# Altium project meter.PrjPCB
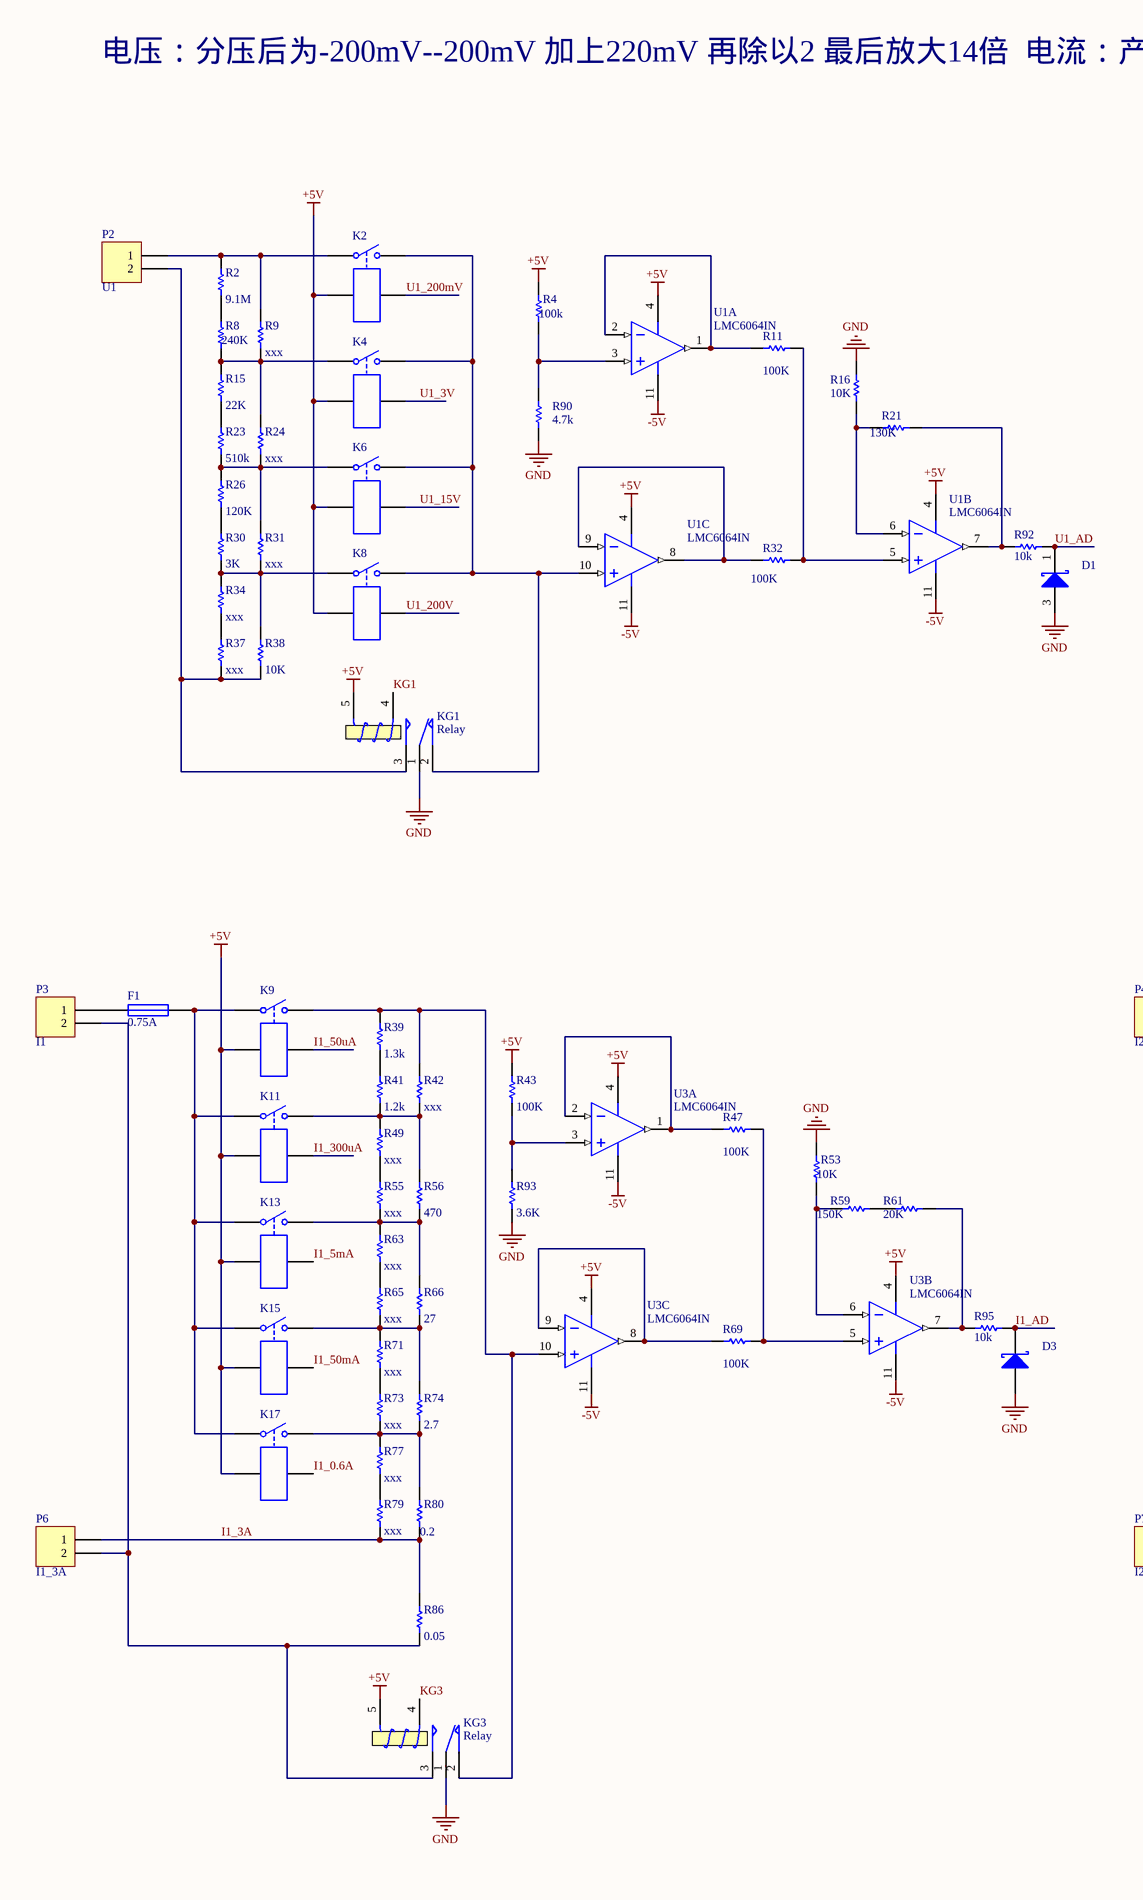
[diagram p0: Sheet.SchDoc, left]
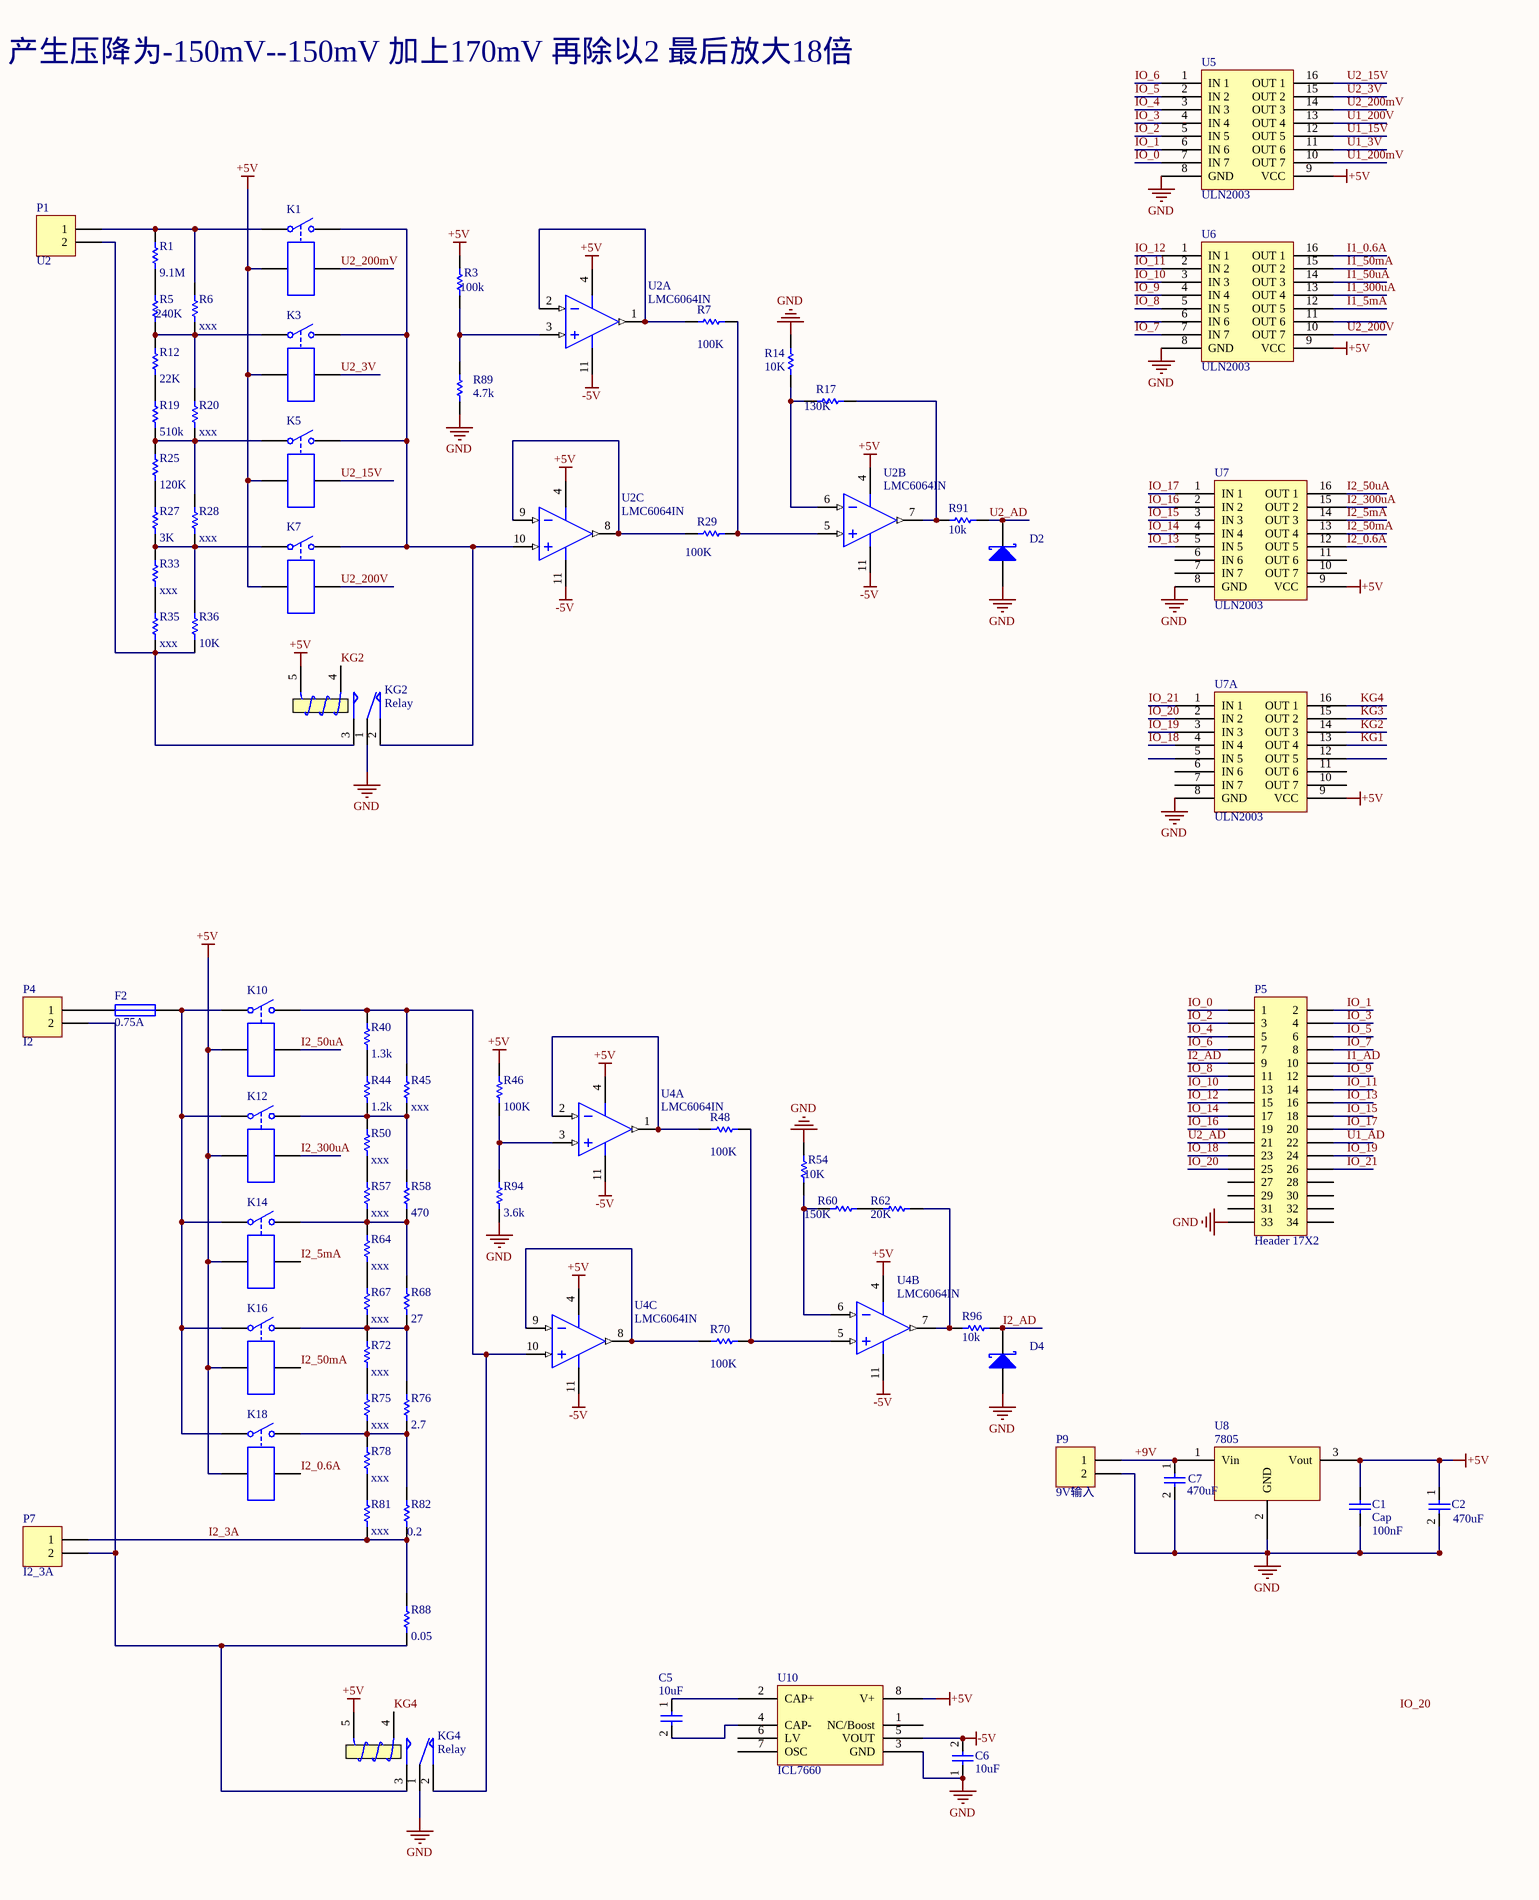
[diagram p1: Sheet.SchDoc, right]
1 sheet, 137 parts. Net scope: global (net labels, ports and power ports of the same name join across sheets).
Board file: PCB.PcbDoc

## Sheet Sheet.SchDoc
size A2

### Parts
C1  Cap  value 100nF  [0805]
C2  value 470uF  [RB8mm_3.5mm]  (hidden comment: Cap)
C5  value 10uF  [RB4.5mm_1.5mm]  (hidden comment: Cap)
C6  value 10uF  [RB4.5mm_1.5mm]  (hidden comment: Cap)
C7  value 470uF  [RB8mm_3.5mm]  (hidden comment: Cap)
D1  (no value)  [D1206]
D2  (no value)  [D1206]
D3  (no value)  [D1206]
D4  (no value)  [D1206]
F1  0.75A  [1812]
F2  0.75A  [1812]
K1  Relay-SPST  [MyRelay]  (value not drawn)
K2  Relay-SPST  [MyRelay]  (value not drawn)
K3  Relay-SPST  [MyRelay]  (value not drawn)
K4  Relay-SPST  [MyRelay]  (value not drawn)
K5  Relay-SPST  [MyRelay]  (value not drawn)
K6  Relay-SPST  [MyRelay]  (value not drawn)
K7  Relay-SPST  [MyRelay]  (value not drawn)
K8  Relay-SPST  [MyRelay]  (value not drawn)
K9  Relay-SPST  [MyRelay]  (value not drawn)
K10  Relay-SPST  [MyRelay]  (value not drawn)
K11  Relay-SPST  [MyRelay]  (value not drawn)
K12  Relay-SPST  [MyRelay]  (value not drawn)
K13  Relay-SPST  [MyRelay]  (value not drawn)
K14  Relay-SPST  [MyRelay]  (value not drawn)
K15  Relay-SPST  [MyRelay]  (value not drawn)
K16  Relay-SPST  [MyRelay]  (value not drawn)
K17  Relay-SPST  [MyRelay]  (value not drawn)
K18  Relay-SPST  [MyRelay]  (value not drawn)
KG1  Relay  [RELAY_HK4101F]
KG2  Relay  [RELAY_HK4101F]
KG3  Relay  [RELAY_HK4101F]
KG4  Relay  [RELAY_HK4101F]
P1  U2  [MyCon2]
P2  U1  [MyCon2]
P3  I1  [MyCon2]
P4  I2  [MyCon2]
P5  Header 17X2  [IDC34S]
P6  I1_3A  [MyCon2]
P7  I2_3A  [MyCon2]
P9  9V输入  [XH2.0-2p]
R1  value 9.1M  [0603R]  (hidden comment: Res1)
R2  value 9.1M  [0603R]  (hidden comment: Res1)
R3  value 100k  [0603R]  (hidden comment: Res1)
R4  value 100k  [0603R]  (hidden comment: Res1)
R5  value 240K  [0603R]  (hidden comment: Res1)
R6  value xxx  [0603R]  (hidden comment: Res1)
R7  value 100K  [0603R]  (hidden comment: Res1)
R8  value 240K  [0603R]  (hidden comment: Res1)
R9  value xxx  [0603R]  (hidden comment: Res1)
R11  value 100K  [0603R]  (hidden comment: Res1)
R12  value 22K  [0603R]  (hidden comment: Res1)
R14  value 10K  [0603R]  (hidden comment: Res1)
R15  value 22K  [0603R]  (hidden comment: Res1)
R16  value 10K  [0603R]  (hidden comment: Res1)
R17  value 130K  [0603R]  (hidden comment: Res1)
R19  value 510k  [0603R]  (hidden comment: Res1)
R20  value xxx  [0603R]  (hidden comment: Res1)
R21  value 130K  [0603R]  (hidden comment: Res1)
R23  value 510k  [0603R]  (hidden comment: Res1)
R24  value xxx  [0603R]  (hidden comment: Res1)
R25  value 120K  [0603R]  (hidden comment: Res1)
R26  value 120K  [0603R]  (hidden comment: Res1)
R27  value 3K  [0603R]  (hidden comment: Res1)
R28  value xxx  [0603R]  (hidden comment: Res1)
R29  value 100K  [0603R]  (hidden comment: Res1)
R30  value 3K  [0603R]  (hidden comment: Res1)
R31  value xxx  [0603R]  (hidden comment: Res1)
R32  value 100K  [0603R]  (hidden comment: Res1)
R33  value xxx  [0603R]  (hidden comment: Res1)
R34  value xxx  [0603R]  (hidden comment: Res1)
R35  value xxx  [0603R]  (hidden comment: Res1)
R36  value 10K  [0603R]  (hidden comment: Res1)
R37  value xxx  [0603R]  (hidden comment: Res1)
R38  value 10K  [0603R]  (hidden comment: Res1)
R39  value 1.3k  [1206]  (hidden comment: Res1)
R40  value 1.3k  [1206]  (hidden comment: Res1)
R41  value 1.2k  [1206]  (hidden comment: Res1)
R42  value xxx  [1206]  (hidden comment: Res1)
R43  value 100K  [0603R]  (hidden comment: Res1)
R44  value 1.2k  [1206]  (hidden comment: Res1)
R45  value xxx  [1206]  (hidden comment: Res1)
R46  value 100K  [0603R]  (hidden comment: Res1)
R47  value 100K  [0603R]  (hidden comment: Res1)
R48  value 100K  [0603R]  (hidden comment: Res1)
R49  value xxx  [1206]  (hidden comment: Res1)
R50  value xxx  [1206]  (hidden comment: Res1)
R53  value 10K  [0603R]  (hidden comment: Res1)
R54  value 10K  [0603R]  (hidden comment: Res1)
R55  value xxx  [1206]  (hidden comment: Res1)
R56  value 470  [1206]  (hidden comment: Res1)
R57  value xxx  [1206]  (hidden comment: Res1)
R58  value 470  [1206]  (hidden comment: Res1)
R59  value 150K  [0603R]  (hidden comment: Res1)
R60  value 150K  [0603R]  (hidden comment: Res1)
R61  value 20K  [0603R]  (hidden comment: Res1)
R62  value 20K  [0603R]  (hidden comment: Res1)
R63  value xxx  [1206]  (hidden comment: Res1)
R64  value xxx  [1206]  (hidden comment: Res1)
R65  value xxx  [1206]  (hidden comment: Res1)
R66  value 27  [1206]  (hidden comment: Res1)
R67  value xxx  [1206]  (hidden comment: Res1)
R68  value 27  [1206]  (hidden comment: Res1)
R69  value 100K  [0603R]  (hidden comment: Res1)
R70  value 100K  [0603R]  (hidden comment: Res1)
R71  value xxx  [1206]  (hidden comment: Res1)
R72  value xxx  [1206]  (hidden comment: Res1)
R73  value xxx  [1206]  (hidden comment: Res1)
R74  value 2.7  [1206]  (hidden comment: Res1)
R75  value xxx  [1206]  (hidden comment: Res1)
R76  value 2.7  [1206]  (hidden comment: Res1)
R77  value xxx  [1206]  (hidden comment: Res1)
R78  value xxx  [1206]  (hidden comment: Res1)
R79  value xxx  [1206]  (hidden comment: Res1)
R80  value 0.2  [1206]  (hidden comment: Res1)
R81  value xxx  [1206]  (hidden comment: Res1)
R82  value 0.2  [1206]  (hidden comment: Res1)
R86  value 0.05  [MY2512]  (hidden comment: Res1)
R88  value 0.05  [MY2512]  (hidden comment: Res1)
R89  value 4.7k  [0603R]  (hidden comment: Res1)
R90  value 4.7k  [0603R]  (hidden comment: Res1)
R91  value 10k  [0603R]  (hidden comment: Res1)
R92  value 10k  [0603R]  (hidden comment: Res1)
R93  value 3.6K  [0603R]  (hidden comment: Res1)
R94  value 3.6k  [0603R]  (hidden comment: Res1)
R95  value 10k  [0603R]  (hidden comment: Res1)
R96  value 10k  [0603R]  (hidden comment: Res1)
U1  LMC6064IN  [N14A]  (parts A,B,C of 4)
U2  LMC6064IN  [N14A]  (parts A,B,C of 4)
U3  LMC6064IN  [N14A]  (parts A,B,C of 4)
U4  LMC6064IN  [N14A]  (parts A,B,C of 4)
U5  ULN2003  [DIP16]
U6  ULN2003  [DIP16]
U7  ULN2003  [DIP16]
U7A  ULN2003  [DIP16]
U8  7805  [78xx]
U10  ICL7660  [DIP8]

### Nets
+5V: C1.2 C2.1 K1.3 K2.3 K3.3 K4.3 K5.3 K6.3 K7.3 K8.3 K9.3 K10.3 K11.3 K12.3 K13.3 K14.3 K15.3 K16.3 K17.3 K18.3 KG1.5(T2) KG2.5(T2) KG3.5(T2) KG4.5(T2) R3.2 R4.2 R43.2 R46.2 U1.4(V+) U2.4(V+) U3.4(V+) U4.4(V+) U5.9(VCC) U6.9(VCC) U7.9(VCC) U7A.9(VCC) U8.3(Vout) U10.8(V+)
-5V: C6.2 U1.11(V-) U2.11(V-) U3.11(V-) U4.11(V-) U10.5(VOUT)
GND: C1.1 C2.2 C6.1 C7.2 D1.3(A) D2.3(A) D3.3(A) D4.3(A) KG1.1(COM) KG2.1(COM) KG3.1(COM) KG4.1(COM) P5.33 P9.2 R14.1 R16.1 R53.1 R54.1 R89.1 R90.1 R93.1 R94.1 U5.8(GND) U6.8(GND) U7.8(GND) U7A.8(GND) U8.2(GND) U10.3(GND)
+9V: C7.1 P9.1 U8.1(Vin)
I1_0.6A: K17.4 U6.16(OUT_1)
I1_3A: P6.1 R79.1 R80.1 R86.2
I1_5mA: K13.4 U6.12(OUT_5)
I1_50mA: K15.4 U6.15(OUT_2)
I1_50uA: K9.4 U6.14(OUT_3)
I1_300uA: K11.4 U6.13(OUT_4)
I1_AD: D3.1(K) P5.10 R95.1
I2_0.6A: K18.4 U7.12(OUT_5)
I2_3A: P7.1 R81.1 R82.1 R88.2
I2_5mA: K14.4 U7.14(OUT_3)
I2_50mA: K16.4 U7.13(OUT_4)
I2_50uA: K10.4 U7.16(OUT_1)
I2_300uA: K12.4 U7.15(OUT_2)
I2_AD: D4.1(K) P5.9 R96.1
IO_0: P5.1 U5.7(IN_7)
IO_1: P5.2 U5.6(IN_6)
IO_2: P5.3 U5.5(IN_5)
IO_3: P5.4 U5.4(IN_4)
IO_4: P5.5 U5.3(IN_3)
IO_5: P5.6 U5.2(IN_2)
IO_6: P5.7 U5.1(IN_1)
IO_7: P5.8 U6.7(IN_7)
IO_8: P5.11 U6.5(IN_5)
IO_9: P5.12 U6.4(IN_4)
IO_10: P5.13 U6.3(IN_3)
IO_11: P5.14 U6.2(IN_2)
IO_12: P5.15 U6.1(IN_1)
IO_13: P5.16 U7.5(IN_5)
IO_14: P5.17 U7.4(IN_4)
IO_15: P5.18 U7.3(IN_3)
IO_16: P5.19 U7.2(IN_2)
IO_17: P5.20 U7.1(IN_1)
IO_18: P5.23 U7A.4(IN_4)
IO_19: P5.24 U7A.3(IN_3)
IO_20: P5.25 U7A.2(IN_2)
IO_21: P5.26 U7A.1(IN_1)
KG1: KG1.4(T1) U7A.13(OUT_4)
KG2: KG2.4(T1) U7A.14(OUT_3)
KG3: KG3.4(T1) U7A.15(OUT_2)
KG4: KG4.4(T1) U7A.16(OUT_1)
U1_3V: K4.4 U5.11(OUT_6)
U1_15V: K6.4 U5.12(OUT_5)
U1_200mV: K2.4 U5.10(OUT_7)
U1_200V: K8.4 U5.13(OUT_4)
U1_AD: D1.1(K) P5.22 R92.1
U2_3V: K3.4 U5.15(OUT_2)
U2_15V: K5.4 U5.16(OUT_1)
U2_200mV: K1.4 U5.14(OUT_3)
U2_200V: K7.4 U6.10(OUT_7)
U2_AD: D2.1(K) P5.21 R91.1
NetC5_1: C5.1 U10.2(CAP+)
NetC5_2: C5.2 U10.4(CAP-)
NetF1_1: F1.1 P3.1
NetF1_2: F1.2 K9.1 K11.1 K13.1 K15.1 K17.1
NetF2_1: F2.1 P4.1
NetF2_2: F2.2 K10.1 K12.1 K14.1 K16.1 K18.1
NetK1_1: K1.1 P1.1 R1.2 R6.2
NetK1_2: K1.2 K3.2 K5.2 K7.2 KG2.2(NC) U2.10(IN3+)
NetK2_1: K2.1 P2.1 R2.2 R9.2
NetK2_2: K2.2 K4.2 K6.2 K8.2 KG1.2(NC) U1.10(IN3+)
NetK3_1: K3.1 R5.1 R6.1 R12.2 R20.2
NetK4_1: K4.1 R8.1 R9.1 R15.2 R24.2
NetK5_1: K5.1 R19.1 R20.1 R25.2 R28.2
NetK6_1: K6.1 R23.1 R24.1 R26.2 R31.2
NetK7_1: K7.1 R27.1 R28.1 R33.2 R36.2
NetK8_1: K8.1 R30.1 R31.1 R34.2 R38.2
NetK9_2: K9.2 KG3.2(NC) R39.2 R42.2 U3.10(IN3+)
NetK10_2: K10.2 KG4.2(NC) R40.2 R45.2 U4.10(IN3+)
NetK11_2: K11.2 R41.1 R42.1 R49.2 R56.2
NetK12_2: K12.2 R44.1 R45.1 R50.2 R58.2
NetK13_2: K13.2 R55.1 R56.1 R63.2 R66.2
NetK14_2: K14.2 R57.1 R58.1 R64.2 R68.2
NetK15_2: K15.2 R65.1 R66.1 R71.2 R74.2
NetK16_2: K16.2 R67.1 R68.1 R72.2 R76.2
NetK17_2: K17.2 R73.1 R74.1 R77.2 R80.2
NetK18_2: K18.2 R75.1 R76.1 R78.2 R82.2
NetKG1_3: KG1.3(NO) P2.2 R37.1 R38.1
NetKG2_3: KG2.3(NO) P1.2 R35.1 R36.1
NetKG3_3: KG3.3(NO) P3.2 P6.2 R86.1
NetKG4_3: KG4.3(NO) P4.2 P7.2 R88.1
NetR1_1: R1.1 R5.2
NetR2_1: R2.1 R8.2
NetR3_1: R3.1 R89.2 U2.3(IN1+)
NetR4_1: R4.1 R90.2 U1.3(IN1+)
NetR7_1: R7.1 R29.1 U2.5(IN2+)
NetR7_2: R7.2 U2.1(OUT1) U2.2(IN1-)
NetR11_1: R11.1 R32.1 U1.5(IN2+)
NetR11_2: R11.2 U1.1(OUT1) U1.2(IN1-)
NetR12_1: R12.1 R19.2
NetR14_2: R14.2 R17.1 U2.6(IN2-)
NetR15_1: R15.1 R23.2
NetR16_2: R16.2 R21.1 U1.6(IN2-)
NetR17_2: R17.2 R91.2 U2.7(OUT2)
NetR21_2: R21.2 R92.2 U1.7(OUT2)
NetR25_1: R25.1 R27.2
NetR26_1: R26.1 R30.2
NetR29_2: R29.2 U2.8(OUT3) U2.9(IN3-)
NetR32_2: R32.2 U1.8(OUT3) U1.9(IN3-)
NetR33_1: R33.1 R35.2
NetR34_1: R34.1 R37.2
NetR39_1: R39.1 R41.2
NetR40_1: R40.1 R44.2
NetR43_1: R43.1 R93.2 U3.3(IN1+)
NetR46_1: R46.1 R94.2 U4.3(IN1+)
NetR47_1: R47.1 R69.1 U3.5(IN2+)
NetR47_2: R47.2 U3.1(OUT1) U3.2(IN1-)
NetR48_1: R48.1 R70.1 U4.5(IN2+)
NetR48_2: R48.2 U4.1(OUT1) U4.2(IN1-)
NetR49_1: R49.1 R55.2
NetR50_1: R50.1 R57.2
NetR53_2: R53.2 R59.1 U3.6(IN2-)
NetR54_2: R54.2 R60.1 U4.6(IN2-)
NetR59_2: R59.2 R61.1
NetR60_2: R60.2 R62.1
NetR61_2: R61.2 R95.2 U3.7(OUT2)
NetR62_2: R62.2 R96.2 U4.7(OUT2)
NetR63_1: R63.1 R65.2
NetR64_1: R64.1 R67.2
NetR69_2: R69.2 U3.8(OUT3) U3.9(IN3-)
NetR70_2: R70.2 U4.8(OUT3) U4.9(IN3-)
NetR71_1: R71.1 R73.2
NetR72_1: R72.1 R75.2
NetR77_1: R77.1 R79.2
NetR78_1: R78.1 R81.2

Not connected (* = marked no-connect by the designer): P5 27 28 29 30 31 32 34; U6 6(IN_6) 11(OUT_6); U7 6(IN_6) 7(IN_7) 10(OUT_7) 11(OUT_6); U7A 5(IN_5) 6(IN_6) 7(IN_7) 10(OUT_7) 11(OUT_6) 12(OUT_5); U10 1(NC/Boost) 6(LV) 7(OSC)

### Notes on the sheet
- 电压：分压后为-200mV--200mV 加上220mV 再除以2 最后放大14倍  电流：产生压降为-150mV--150mV 加上170mV 再除以2 最后放大18倍
- Labels drawn without touching a wire or pin: IO_20

### Library data of the parts
C1 C2 C5-C7 = Cap: Capacitor; Published: 8-Jun-2000; LatestRevisionDate: 17-Jul-2002; LatestRevisionNote: Re-released for DXP Platform.; PackageReference: RAD-0.3; Publisher: Altium Limited
D1-D4 = Diode 10TQ035: Schottky Rectifier; Note: Terminal 2 is the TAB and is electrically connected to the cathode; Published: 8-Jun-2000; LatestRevisionDate: 17-Jul-2002; LatestRevisionNote: Re-released for DXP Platform.; DatasheetDocument: PD-2.057B; PackageDocument: Feb-1998; PackageReference: TO-220AC; Publisher: Altium Limited; ComponentLink1Description: Manufacturer Link; ComponentLink1URL: http://www.irf.com/; ComponentLink2Description: Datasheet; ComponentLink2URL: http://www.irf.com/product-info/datasheets/data/10tq.pdf
F1 F2 = Fuse 1: Fuse; Published: 8-Jun-2000; LatestRevisionDate: 17-Jul-2002; LatestRevisionNote: Re-released for DXP Platform.; PackageReference: PIN-W2/E2.8; Publisher: Altium Limited
K1-K18 = Relay-SPST: Single-Pole Single-Throw Relay; Published: 24-Mar-1999; LatestRevisionDate: 17-Jul-2002; LatestRevisionNote: Re-released for DXP Platform.; PackageReference: MODULE4; Publisher: Altium Limited
KG1-KG4 = Relay: SPDT Relay; Published: 8-Jun-2000; LatestRevisionDate: 17-Jul-2002; LatestRevisionNote: Re-released for DXP Platform.; PackageReference: MODULE5B; Publisher: Altium Limited
P1-P4 P6 P7 P9 = Header 2: Header, 2-Pin; LatestRevisionDate: 17-Jul-2002; LatestRevisionNote: Re-released for DXP Platform.; Publisher: Altium Limited
P5 = Header 17X2: Header, 17-Pin, Dual row; LatestRevisionDate: 17-Jul-2002; LatestRevisionNote: Re-released for DXP Platform.; Publisher: Altium Limited
R1-R9 R11 R12 R14-R17 R19-R21 R23-R50 R53-R82 R86 R88-R96 = Res1: Resistor; Published: 8-Jun-2000; LatestRevisionDate: 17-Jul-2002; LatestRevisionNote: Re-released for DXP Platform.; PackageReference: AXIAL-0.3; Publisher: Altium Limited
U1-U4 = LMC6064IN: Precision CMOS Quad Micropower Operational Amplifier; Manufacturer: National Semiconductor; CompType: Amplifiers; PackageTopMarking: NSUZXYYTTE#*LMC6064IN; Published: 4-Dec-2008; LatestRevisionDate: 13-Jan-2009; LatestRevisionNote: Sim Model Added.; DatasheetVersion: Apr-2001; PackageVersion: revG, May-2006; PackageReference: N14A; Publisher: Altium Limited; PackageDescription: MDIP, .750 x .250 x.130in, 14 Lead, .100in Pitch; PartNumber: LMC6064IN; RoHS: O; PinCount: 14; DigiKeyPartNumber: LMC6064IN-ND; Code_JEDEC: MS-001-AA; ComponentLink1Description: LMC6064 Datasheet; ComponentLink1URL: http://www.national.com/ds/LM/LMC6064.pdf; ComponentLink2Description: LMC6064 Web Page; ComponentLink2URL: http://www.national.com/pf/LM/LMC6064.html; ComponentLink3Description: N14A Package Page; ComponentLink3URL: http://www.national.com/packaging/folders/n14a.html